# EAGLE design Sequei_board1 (EAGLE 9.1.1)
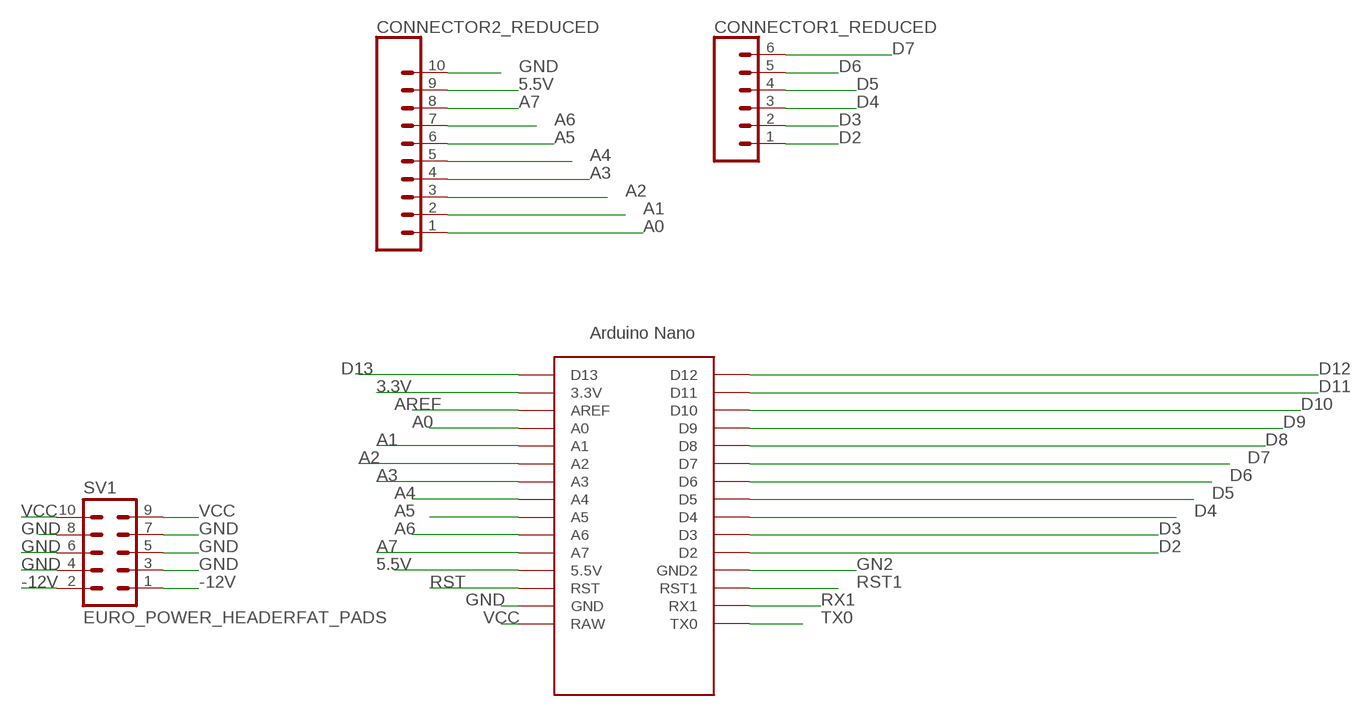
[diagram p0: schematic, sheet 1]

## Parts
CONNECTOR1_REDUCED  CONN_06LONGPADS  [1X06_LONGPADS]
CONNECTOR2_REDUCED  CONN_10_LONGPADS10_LONGPADS  [1X10_LONGPADS]
SV1  EURO_POWER_HEADERFAT_PADS  [EURO_PWR_HEADER_FAT]
U$1  NANO  [NANO]

## Nets
3.3V: U$1.3.3V
5.5V: CONNECTOR2_REDUCED.9 U$1.5V(5.5V)
-12V: SV1.1 SV1.2
A0: CONNECTOR2_REDUCED.1 U$1.A0
A1: CONNECTOR2_REDUCED.2 U$1.A1
A2: CONNECTOR2_REDUCED.3 U$1.A2
A3: CONNECTOR2_REDUCED.4 U$1.A3
A4: CONNECTOR2_REDUCED.5 U$1.A4
A5: CONNECTOR2_REDUCED.6 U$1.A5
A6: CONNECTOR2_REDUCED.7 U$1.A6
A7: CONNECTOR2_REDUCED.8 U$1.A7
AREF: U$1.AREF
D2: CONNECTOR1_REDUCED.1 U$1.D2
D3: CONNECTOR1_REDUCED.2 U$1.D3
D4: CONNECTOR1_REDUCED.3 U$1.D4
D5: CONNECTOR1_REDUCED.4 U$1.D5
D6: CONNECTOR1_REDUCED.5 U$1.D6
D7: CONNECTOR1_REDUCED.6 U$1.D7
D8: U$1.D8
D9: U$1.D9
D10: U$1.D10
D11: U$1.D11
D12: U$1.D12
D13: U$1.D13
GN2: U$1.GND1(GND2)
GND: CONNECTOR2_REDUCED.10 SV1.3 SV1.4 SV1.5 SV1.6 SV1.7 SV1.8 U$1.GND
RST: U$1.RST
RST1: U$1.RST1
RX1: U$1.RX1
TX0: U$1.TX0
VCC: SV1.9 SV1.10 U$1.RAW

## Library data of the parts
CONNECTOR1_REDUCED = SparkFun-Connectors:CONN_06: Multi connection point. Often used as Generic Header-pin footprint for 0.1 inch spaced/style header connections On any of the 0.1 inch spaced packages, you can populate with these: Break Away Headers - Straight <https://www.sparkfun.com/products/116> (PRT-00116) Break Away Male Headers - Right Angle <https://www.sparkfun.com/products/553> (PRT-00553) Female Headers <https://www.sparkfun.com/products/115> (PRT-00115) Break Away Headers - Machine Pin <https://www.sparkfun.com/products/117> (PRT-00117) Break Away Female Headers - Swiss Machine Pin <https://www.sparkfun.com/products/743> (PRT-00743) Arduino Stackable Header - 6 Pin <https://www.sparkfun.com/products/9280> (PRT-09280) For SCREWTERMINALS and SPRING TERMINALS visit here: Screw Terimnals on SparkFun.com <https://www.sparkfun.com/search/results?term=Screw+Terminals> (5mm/3.5mm/2.54mm spacing) This device is also useful as a general connection point to wire up your design to another part of your project. Our various solder wires solder well into these plated through hole pads. Hook-Up Wire - Assortment (Stranded, 22 AWG) <https://www.sparkfun.com/products/11375> (PRT-11375) Hook-Up Wire - Assortment (Solid Core, 22 AWG) <https://www.sparkfun.com/products/11367> (PRT-11367) View the entire wire category on our website here <https://www.sparkfun.com/categories/141>
CONNECTOR2_REDUCED = 10_Long_Pads:CONN_10_LONGPADS: Multi connection point. Often used as Generic Header-pin footprint for 0.1 inch spaced/style header connections On any of the 0.1 inch spaced packages, you can populate with these: Break Away Headers - Straight <https://www.sparkfun.com/products/116> (PRT-00116) Break Away Male Headers - Right Angle <https://www.sparkfun.com/products/553> (PRT-00553) Female Headers <https://www.sparkfun.com/products/115> (PRT-00115) Break Away Headers - Machine Pin <https://www.sparkfun.com/products/117> (PRT-00117) Break Away Female Headers - Swiss Machine Pin <https://www.sparkfun.com/products/743> (PRT-00743) For SCREWTERMINALS and SPRING TERMINALS visit here: Screw Terimnals on SparkFun.com <https://www.sparkfun.com/search/results?term=Screw+Terminals> (5mm/3.5mm/2.54mm spacing) This device is also useful as a general connection point to wire up your design to another part of your project. Our various solder wires solder well into these plated through hole pads. Hook-Up Wire - Assortment (Stranded, 22 AWG) <https://www.sparkfun.com/products/11375> (PRT-11375) Hook-Up Wire - Assortment (Solid Core, 22 AWG) <https://www.sparkfun.com/products/11367> (PRT-11367) View the entire wire category on our website here <https://www.sparkfun.com/categories/141>
SV1 = MusicThingModular:EURO_POWER_HEADER: Power Header 10 pin power header for Eurorack Power Supplies Variants with fatter pads for easier soldering, and the LOCK variant which has 5mil offset pins to hold the component in place before soldering
U$1 = Arduino-clone_EDITED_coordinates:NANO: Arduino Nano

## Board
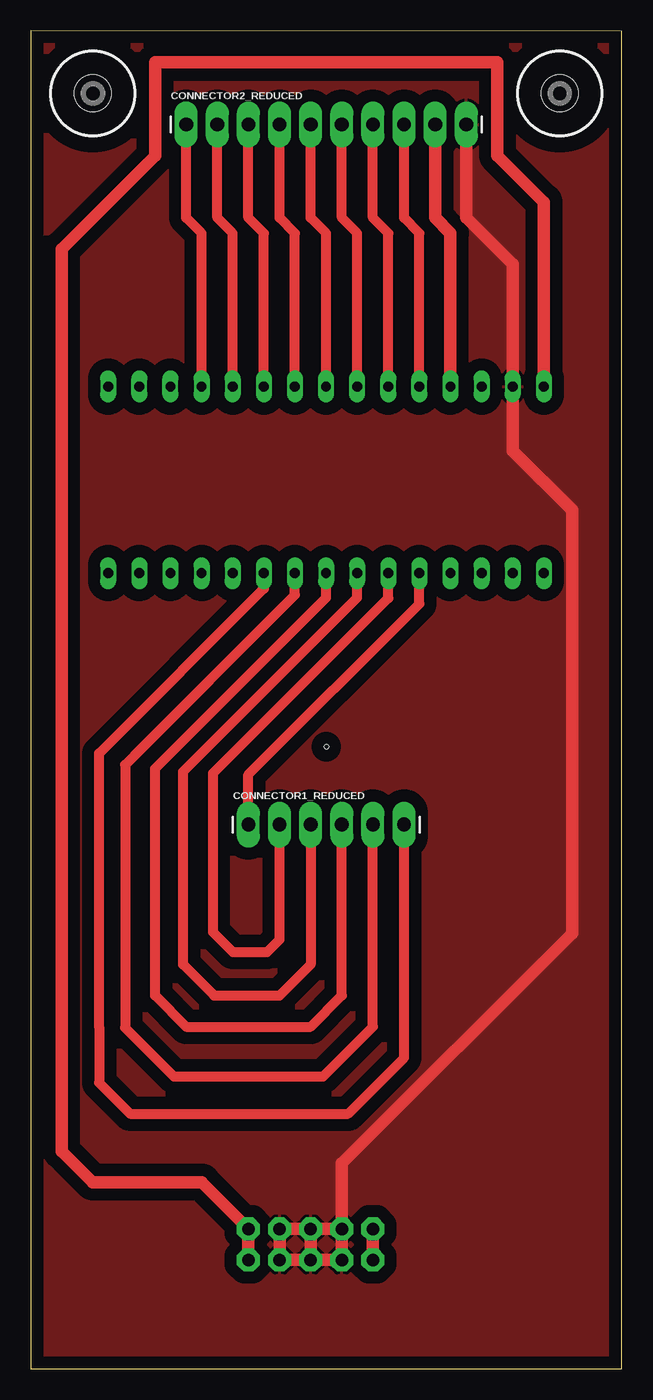
[diagram p1: board, top side]
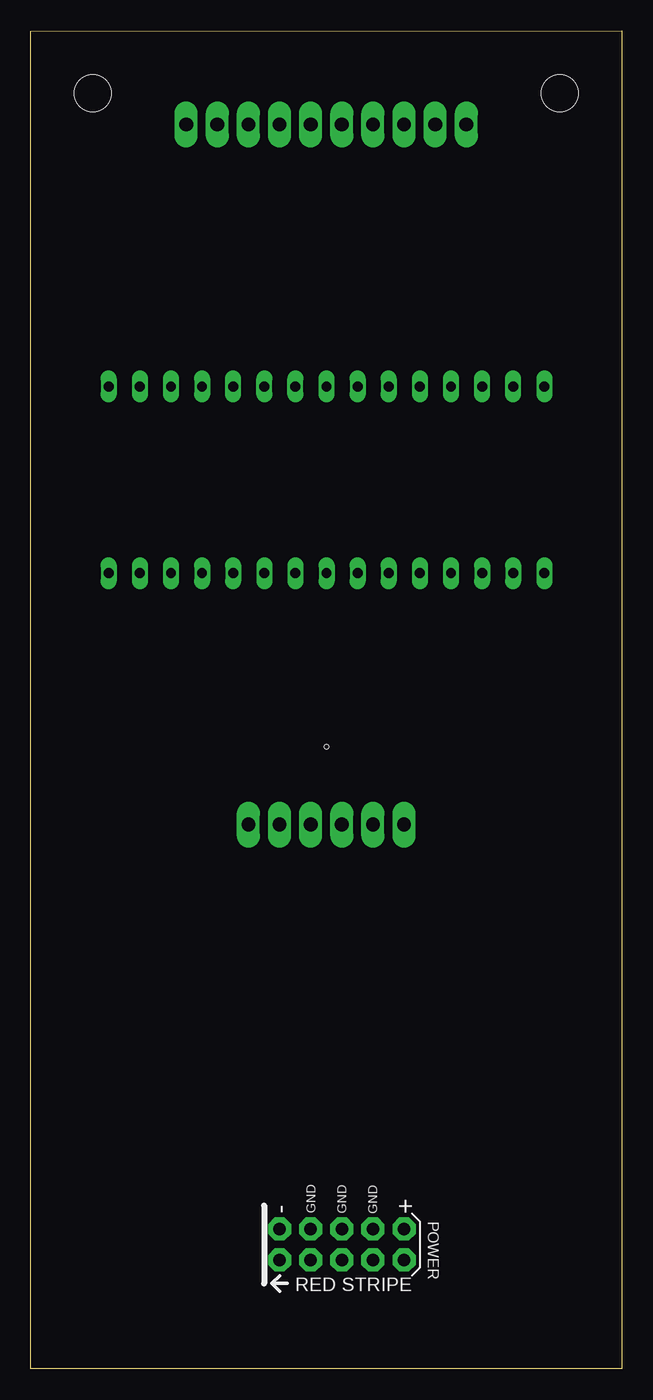
[diagram p2: board, bottom side, seen from below]

Size 48.26 x 109.27 mm. Coordinates in mm from the lower left corner, seen from the top.
Outline: 0,0 48.26,0 48.26,109.22 0,109.27 0,0
Copper layers (1*16): Top 0.035mm / dielectric 1.5mm / Bottom 0.035mm
Design rules "default": minimum track width 6mil, minimum drill 0.35mm, track to track 6mil, track to pad 6mil, pad to pad 6mil, via to via 6mil, smd to smd 6mil, copper to edge 40mil, drill to drill 6mil, minimum pad ring 10mil, minimum via ring 8mil, stop-mask expansion 4mil, vias tented up to drill 0mil, thermal gap 10mil
Holes 0.35 mm at 24.13,50.8

### Footprints (pad centres in the part's own frame; a part is rotated, then mirrored left to right if it is on the bottom)
1X06_LONGPADS = drill 1.118 pad 1.88 long: 1 0,0; 2 2.54,0; 3 5.08,0; 4 7.62,0; 5 10.16,0; 6 12.7,0
1X10_LONGPADS = drill 1.118 pad 1.88 long: 1 0,0; 2 2.54,0; 3 5.08,0; 4 7.62,0; 5 10.16,0; 6 12.7,0; 7 15.24,0; 8 17.78,0; 9 20.32,0; 10 22.86,0
DRIL-3 = hole 3: 0,0
EURO_PWR_HEADER_FAT = drill 1.016 pad 1.88 octagon: 1 -5.08,-1.27; 2 -5.08,1.27; 3 -2.54,-1.27; 4 -2.54,1.27; 5 0,-1.27; 6 0,1.27; 7 2.54,-1.27; 8 2.54,1.27; 9 5.08,-1.27; 10 5.08,1.27
NANO = drill 0.8 long: 3.3V 0,33.02; 5V 0,7.62; A0 0,27.94; A1 0,25.4; A2 0,22.86; A3 0,20.32; A4 0,17.78; A5 0,15.24; A6 0,12.7; A7 0,10.16; AREF 0,30.48; D2 15.24,10.16; D3 15.24,12.7; D4 15.24,15.24; D5 15.24,17.78; D6 15.24,20.32; D7 15.24,22.86; D8 15.24,25.4; D9 15.24,27.94; D10 15.24,30.48; D11 15.24,33.02; D12 15.24,35.56; D13 0,35.56; GND 0,2.54; GND1 15.24,7.62; RAW 0,0; RST 0,5.08; RST1 15.24,5.08; RX1 15.24,2.54; TX0 15.24,0

### Placement (x,y rotation side)
CONNECTOR1_REDUCED  17.78,44.45 0 top
CONNECTOR2_REDUCED  12.7,101.6 0 top
H1  [DRIL-3]  5.08,104.14 0 top
H2  [DRIL-3]  43.18,104.14 0 top
SV1  22.86,10.16 0 bottom
U$1  41.89,80.21 270 bottom

### Tracks (layer width: path | path; a pad name or v marks a point on that pad's centre or on a via)
5.5V
  Top 1.016: U$1.5V 34.27,92.73 33.02,93.98 CONNECTOR2_REDUCED.9
-12V
  Top 1.016: SV1.1 SV1.2
A0
  Top 0.813: U$1.A0 13.95,92.73 12.7,93.98 CONNECTOR2_REDUCED.1
A1
  Top 0.813: U$1.A1 16.49,92.73 15.24,93.98 CONNECTOR2_REDUCED.2
A2
  Top 0.813: U$1.A2 19.03,92.73 17.78,93.98 CONNECTOR2_REDUCED.3
A3
  Top 0.813: U$1.A3 21.57,92.73 20.32,93.98 CONNECTOR2_REDUCED.4
A4
  Top 0.813: U$1.A4 24.11,92.73 22.86,93.98 CONNECTOR2_REDUCED.5
A5
  Top 0.813: U$1.A5 26.65,92.73 25.4,93.98 CONNECTOR2_REDUCED.6
A6
  Top 0.813: U$1.A6 29.19,92.73 27.94,93.98 CONNECTOR2_REDUCED.7
A7
  Top 0.813: U$1.A7 31.73,92.73 30.48,93.98 CONNECTOR2_REDUCED.8
D2
  Top 0.813: CONNECTOR1_REDUCED.1 17.78,48.51 31.73,62.46 U$1.D2
D3
  Top 0.813: 14.88,48.62 29.19,62.94 U$1.D3 | 14.88,48.62 | 14.88,48.62 14.88,35.67 16.51,34.04 19.3,34.04 20.32,35.05 CONNECTOR1_REDUCED.2
D4
  Top 0.813: CONNECTOR1_REDUCED.3 22.86,33.02 20.32,30.48 14.99,30.48 12.45,33.02 12.45,48.77 26.65,62.97 U$1.D4
D5
  Top 0.813: CONNECTOR1_REDUCED.4 25.4,30.48 22.86,27.94 12.7,27.94 10.16,30.48 10.16,49.02 24.11,62.97 U$1.D5
D6
  Top 0.813: 8.53,50.15 21.57,63.19 | 21.57,63.19 U$1.D6 | 21.57,63.19 7.71,49.33 7.71,27.86 11.68,23.88 23.88,23.88 27.94,27.94 CONNECTOR1_REDUCED.5
D7
  Top 0.813: U$1.D7 19.03,63.7 5.59,50.26 5.59,27.94 5.59,23.37 8.13,20.83 25.91,20.83 30.48,25.4 CONNECTOR1_REDUCED.6
GND
  Top 0.813: 24.13,8.89 SV1.5
  Top 1.016: SV1.6 SV1.8 SV1.7 24.13,8.89 SV1.3 SV1.4 | SV1.6 SV1.5 | SV1.6 SV1.4 | SV1.4 25.4,16.76 44.2,35.56 44.2,70.1 39.35,74.95 U$1.GND 39.35,90.19 35.56,93.98 CONNECTOR2_REDUCED.10
  pour Top (isolate 1): 0,109.22 48.26,109.22 48.26,0 0,0
N$1
  pour Top (isolate 1): 0,109 0,0 48,0 48,110 1,110
VCC
  Top 1.016: U$1.RAW 41.89,95.27 38.1,99.06 38.1,106.68 10.16,106.68 10.16,99.06 2.54,91.44 2.54,63.5 2.54,17.78 5.08,15.24 13.97,15.24 SV1.10 SV1.9

### Text on the board
tDocu: A0 | A7 | 5.5V | GND | D2 | D4 | D7
bDocu: A4 | D13 | 3.3V | AREF | A0 | A1 | A2 | A3 | A4 | A5 | A6 | A7 | 5.5V | RST | GND | RAW | D12 | D11 | D10 | D9 | D8 | D7 | D6 | D5 | D4 | D3 | D2 | GND | RST1 | RX1 | TX0